# Altium schematic sheet Diver Board V1.0.SchDoc
size A3
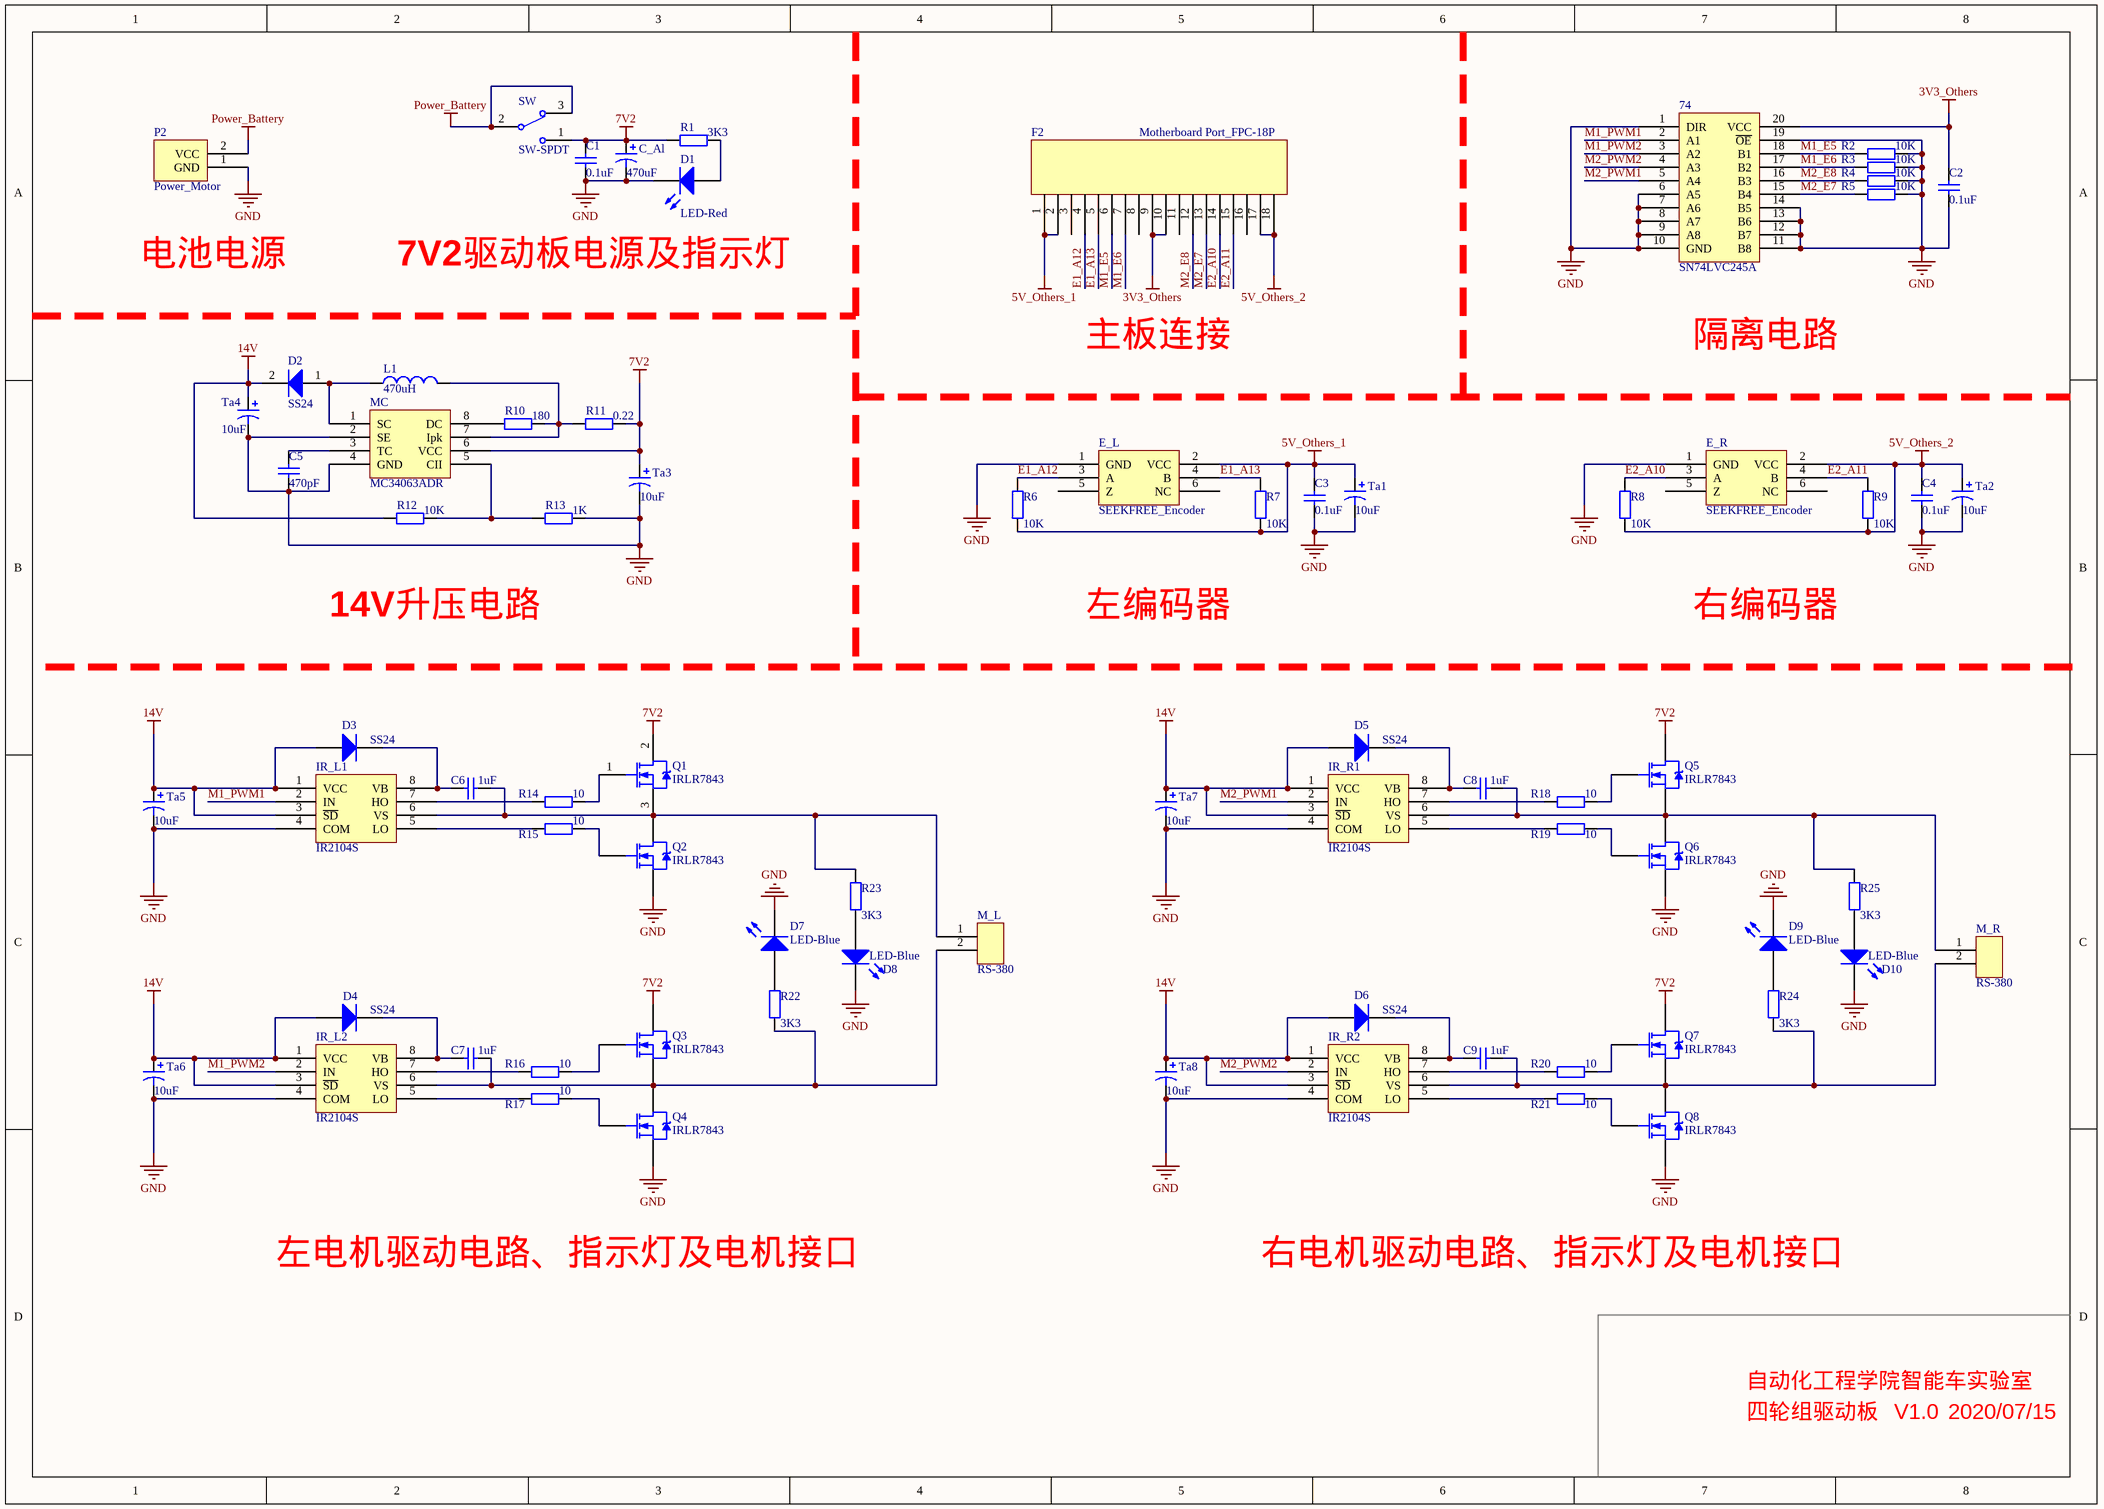
[diagram p0: Diver Board V1.0.SchDoc]

## Parts
74  SN74LVC245A  [74LVC245_SOIC20]
C1  value 0.1uF  [C_0603]
C2  value 0.1uF  [C_0603]
C3  value 0.1uF  [C_0603]
C4  value 0.1uF  [C_0603]
C5  value 470pF  [C_0603]
C6  value 1uF  [C_0603]
C7  value 1uF  [C_0603]
C8  value 1uF  [C_0603]
C9  value 1uF  [C_0603]
C_Al  value 470uF  [C_Al_8*11.5mm]
D1  LED-Red  [LED_0603_R]
D2  SS24  [SS24_SMA]
D3  SS24  [SS24_SMA]
D4  SS24  [SS24_SMA]
D5  SS24  [SS24_SMA]
D6  SS24  [SS24_SMA]
D7  LED-Blue  [LED_0603_B]
D8  LED-Blue  [LED_0603_B]
D9  LED-Blue  [LED_0603_B]
D10  LED-Blue  [LED_0603_B]
E_L  SEEKFREE_Encoder  [Encoder_L_2.54mm]
E_R  SEEKFREE_Encoder  [Encoder_R_2.54mm]
F2  Motherboard Port_FPC-18P  [Motherboard Port_0.5mm]
IR_L1  IR2104S  [IR2104_SOIC8]
IR_L2  IR2104S  [IR2104_SOIC8]
IR_R1  IR2104S  [IR2104_SOIC8]
IR_R2  IR2104S  [IR2104_SOIC8]
L1  value 470uH  [L_12.5*12.5mm]
M_L  RS-380  [Motor_4.7mm]
M_R  RS-380  [Motor_4.7mm]
MC  MC34063ADR  [MC34063_SOIC8]
P2  Power_Motor  [Battery_5mm]
Q1  IRLR7843  [IRLR7843_TO-252]
Q2  IRLR7843  [IRLR7843_TO-252]
Q3  IRLR7843  [IRLR7843_TO-252]
Q4  IRLR7843  [IRLR7843_TO-252]
Q5  IRLR7843  [IRLR7843_TO-252]
Q6  IRLR7843  [IRLR7843_TO-252]
Q7  IRLR7843  [IRLR7843_TO-252]
Q8  IRLR7843  [IRLR7843_TO-252]
R1  value 3K3  [R_0603]
R2  value 10K  [R_0603]
R3  value 10K  [R_0603]
R4  value 10K  [R_0603]
R5  value 10K  [R_0603]
R6  value 10K  [R_0603]
R7  value 10K  [R_0603]
R8  value 10K  [R_0603]
R9  value 10K  [R_0603]
R10  value 180  [R_0603]
R11  value 0.22  [R_0603]
R12  value 10K  [R_0603]
R13  value 1K  [R_0603]
R14  value 10  [R_0603]
R15  value 10  [R_0603]
R16  value 10  [R_0603]
R17  value 10  [R_0603]
R18  value 10  [R_0603]
R19  value 10  [R_0603]
R20  value 10  [R_0603]
R21  value 10  [R_0603]
R22  value 3K3  [R_0603]
R23  value 3K3  [R_0603]
R24  value 3K3  [R_0603]
R25  value 3K3  [R_0603]
SW  SW-SPDT  [SW_4.7mm]
Ta1  value 10uF  [C_Ta_3528B]
Ta2  value 10uF  [C_Ta_3528B]
Ta3  value 10uF  [C_Ta_3528B]
Ta4  value 10uF  [C_Ta_6032C]
Ta5  value 10uF  [C_Ta_6032C]
Ta6  value 10uF  [C_Ta_6032C]
Ta7  value 10uF  [C_Ta_6032C]
Ta8  value 10uF  [C_Ta_6032C]

## Nets
3V3_Others: 74.20(VCC) C2.2 F2.9 F2.10
5V_Others_1: C3.2 E_L.2(VCC) F2.1 F2.2 R6.1 R7.1 Ta1.1
5V_Others_2: C4.2 E_R.2(VCC) F2.17 F2.18 R8.1 R9.1 Ta2.1
7V2: C1.2 C_Al.1 MC.6(VCC) Q1.2(D) Q3.2(D) Q5.2(D) Q7.2(D) R1.1 R11.2 SW.1 Ta3.1
14V: D2.2(K) D3.1(A) D4.1(A) D5.1(A) D6.1(A) IR_L1.1(VCC) IR_L1.3(~{SD}) IR_L2.1(VCC) IR_L2.3(~{SD}) IR_R1.1(VCC) IR_R1.3(~{SD}) IR_R2.1(VCC) IR_R2.3(~{SD}) R12.1 Ta4.1 Ta5.1 Ta6.1 Ta7.1 Ta8.1
GND: 74.1(DIR) 74.6(A5) 74.7(A6) 74.8(A7) 74.9(A8) 74.10(GND) 74.11(B8) 74.12(B7) 74.13(B6) 74.14(B5) 74.19(~{OE}) C1.1 C2.1 C3.1 C4.1 C5.2 C_Al.2 D1.2(K) D7.2(K) D8.2(K) D9.2(K) D10.2(K) E_L.1(GND) E_R.1(GND) IR_L1.4(COM) IR_L2.4(COM) IR_R1.4(COM) IR_R2.4(COM) MC.2(SE) MC.4(GND) P2.1(GND) Q2.3(S) Q4.3(S) Q6.3(S) Q8.3(S) R2.2 R3.2 R4.2 R5.2 R13.2 Ta1.2 Ta2.2 Ta3.2 Ta4.2 Ta5.2 Ta6.2 Ta7.2 Ta8.2
Power_Battery: P2.2(VCC) SW.2 SW.3
E1_A12: E_L.3(A) F2.4 R6.2
E1_A13: E_L.4(B) F2.5 R7.2
E2_A10: E_R.3(A) F2.14 R8.2
E2_A11: E_R.4(B) F2.15 R9.2
M1_E5: 74.18(B1) F2.6 R2.1
M1_E6: 74.17(B2) F2.7 R3.1
M1_PWM1: 74.2(A1) IR_L1.2(IN)
M1_PWM2: 74.3(A2) IR_L2.2(IN)
M2_E7: 74.15(B4) F2.13 R5.1
M2_E8: 74.16(B3) F2.12 R4.1
M2_PWM1: 74.5(A4) IR_R1.2(IN)
M2_PWM2: 74.4(A3) IR_R2.2(IN)
NetC5_1: C5.1 MC.3(TC)
NetC6_1: C6.1 IR_L1.6(VS) M_L.1 Q1.3(S) Q2.2(D) R23.2
NetC6_2: C6.2 D3.2(K) IR_L1.8(VB)
NetC7_1: C7.1 IR_L2.6(VS) M_L.2 Q3.3(S) Q4.2(D) R22.1
NetC7_2: C7.2 D4.2(K) IR_L2.8(VB)
NetC8_1: C8.1 IR_R1.6(VS) M_R.1 Q5.3(S) Q6.2(D) R25.2
NetC8_2: C8.2 D5.2(K) IR_R1.8(VB)
NetC9_1: C9.1 IR_R2.6(VS) M_R.2 Q7.3(S) Q8.2(D) R24.1
NetC9_2: C9.2 D6.2(K) IR_R2.8(VB)
NetD1_1: D1.1(A) R1.2
NetD2_1: D2.1(A) L1.1 MC.1(SC)
NetD7_1: D7.1(A) R22.2
NetD8_1: D8.1(A) R23.1
NetD9_1: D9.1(A) R24.2
NetD10_1: D10.1(A) R25.1
NetIR_L1_5: IR_L1.5(LO) R15.1
NetIR_L1_7: IR_L1.7(HO) R14.1
NetIR_L2_5: IR_L2.5(LO) R17.1
NetIR_L2_7: IR_L2.7(HO) R16.1
NetIR_R1_5: IR_R1.5(LO) R19.1
NetIR_R1_7: IR_R1.7(HO) R18.1
NetIR_R2_5: IR_R2.5(LO) R21.1
NetIR_R2_7: IR_R2.7(HO) R20.1
NetL1_2: L1.2 MC.7(Ipk) R10.2 R11.1
NetMC_5: MC.5(CII) R12.2 R13.1
NetMC_8: MC.8(DC) R10.1
NetQ1_1: Q1.1(G) R14.2
NetQ2_1: Q2.1(G) R15.2
NetQ3_1: Q3.1(G) R16.2
NetQ4_1: Q4.1(G) R17.2
NetQ5_1: Q5.1(G) R18.2
NetQ6_1: Q6.1(G) R19.2
NetQ7_1: Q7.1(G) R20.2
NetQ8_1: Q8.1(G) R21.2

Not connected (* = marked no-connect by the designer): E_L 5(Z) 6(NC); E_R 5(Z) 6(NC); F2 3 8 11 16

## Notes on the sheet
- 电池电源
- 7V2驱动板电源及指示灯
- 主板连接
- 隔离电路
- 14V升压电路
- 左编码器
- 右编码器
- 左电机驱动电路、指示灯及电机接口
- 右电机驱动电路、指示灯及电机接口
- 自动化工程学院智能车实验室
- 四轮组驱动板
- V1.0
- 2020/07/15

## Library data of the parts
74 = 74LVC245
C1-C9 = Cap: Capacitor; Published: 8-Jun-2000; LatestRevisionDate: 17-Jul-2002; LatestRevisionNote: Re-released for DXP Platform.; PackageReference: RAD-0.3; Publisher: Altium Limited; PackageDescription: Radial Cap, Thru-Hole; 2 Leads; 0.3 in Pin Spacing
C_Al Ta1-Ta8 = Cap Pol3: Polarized Capacitor (Surface Mount); Published: 8-Jun-2000; LatestRevisionDate: 29-May-2009; LatestRevisionNote: IPC-7351 Footprint Added.; PackageReference: C0805; Publisher: Altium Limited; PackageDescription: Chip Capacitor
D1 D7-D10 = LED3: Typical BLUE SiC LED; Published: 8-Jun-2000; LatestRevisionDate: 17-Dec-2003; LatestRevisionNote: PCB Footprint replaced.; DatasheetVersion: 16-Apr-2002; PackageVersion: 16-Apr-2002; PackageReference: 3.5X2.8X1.9; Publisher: Altium Limited; PackageDescription: SM LED; 2 C-Bend Leads; Body 3.5 x 2.8 x 1.9 mm, inc leads (LxWxH typ)
D2-D6 = Diode: Default Diode; Published: 8-Jun-2000; LatestRevisionDate: 17-Jul-2002; LatestRevisionNote: Re-released for DXP Platform.; PackageVersion: Sep-1996; PackageReference: SMC; Publisher: Altium Limited; PackageDescription: DO-214-AB/SMC; 2 C-Bend Leads; Body 7.9 x 5.9 mm, inc. leads (LxW); Code_JEDEC: DO-214-AB
F2 = Motherboard Port
IR_L1 IR_L2 IR_R1 IR_R2 = IR2104
L1 = Inductor: Code_IEC: 1005; Published: 8-Jun-2000; LatestRevisionDate: 29-May-2009; LatestRevisionNote: IPC-7351 Footprint Added.; PackageReference: 0402-A; Publisher: Altium Limited; PackageDescription: Chip Inductor; Code_JEITA: 0402
M_L M_R = Motor Port
MC = MC34063
Q1-Q8 = NMOS-2: N-Channel Power MOSFET; Note: Pin 2 is electrically connected to pin 4.; Published: 8-Jun-2000; LatestRevisionDate: 17-Jul-2002; LatestRevisionNote: Re-released for DXP Platform.; DatasheetVersion: PD-9.814; PackageVersion: Feb-1997; PackageReference: TO-220AB; Publisher: Altium Limited; PackageDescription: TO, Thru-Hole, Vertical, Heatsink Mounted; 3 In-Line Leads; Pitch 2.54 mm; ComponentLink1Description: Manufacturer Link; ComponentLink1URL: http://www.irf.com/
R1-R25 = Res2: Resistor; Published: 8-Jun-2000; LatestRevisionDate: 17-Jul-2002; LatestRevisionNote: Re-released for DXP Platform.; PackageReference: AXIAL-0.4; Publisher: Altium Limited; PackageDescription: Axial Device, Thru-Hole; 2 Leads; 0.4 in Pin Spacing